# EAGLE schematic POE_REGULADORES (EAGLE 9.6.2)

## Sheet 1 of 5: CONECTOR POE
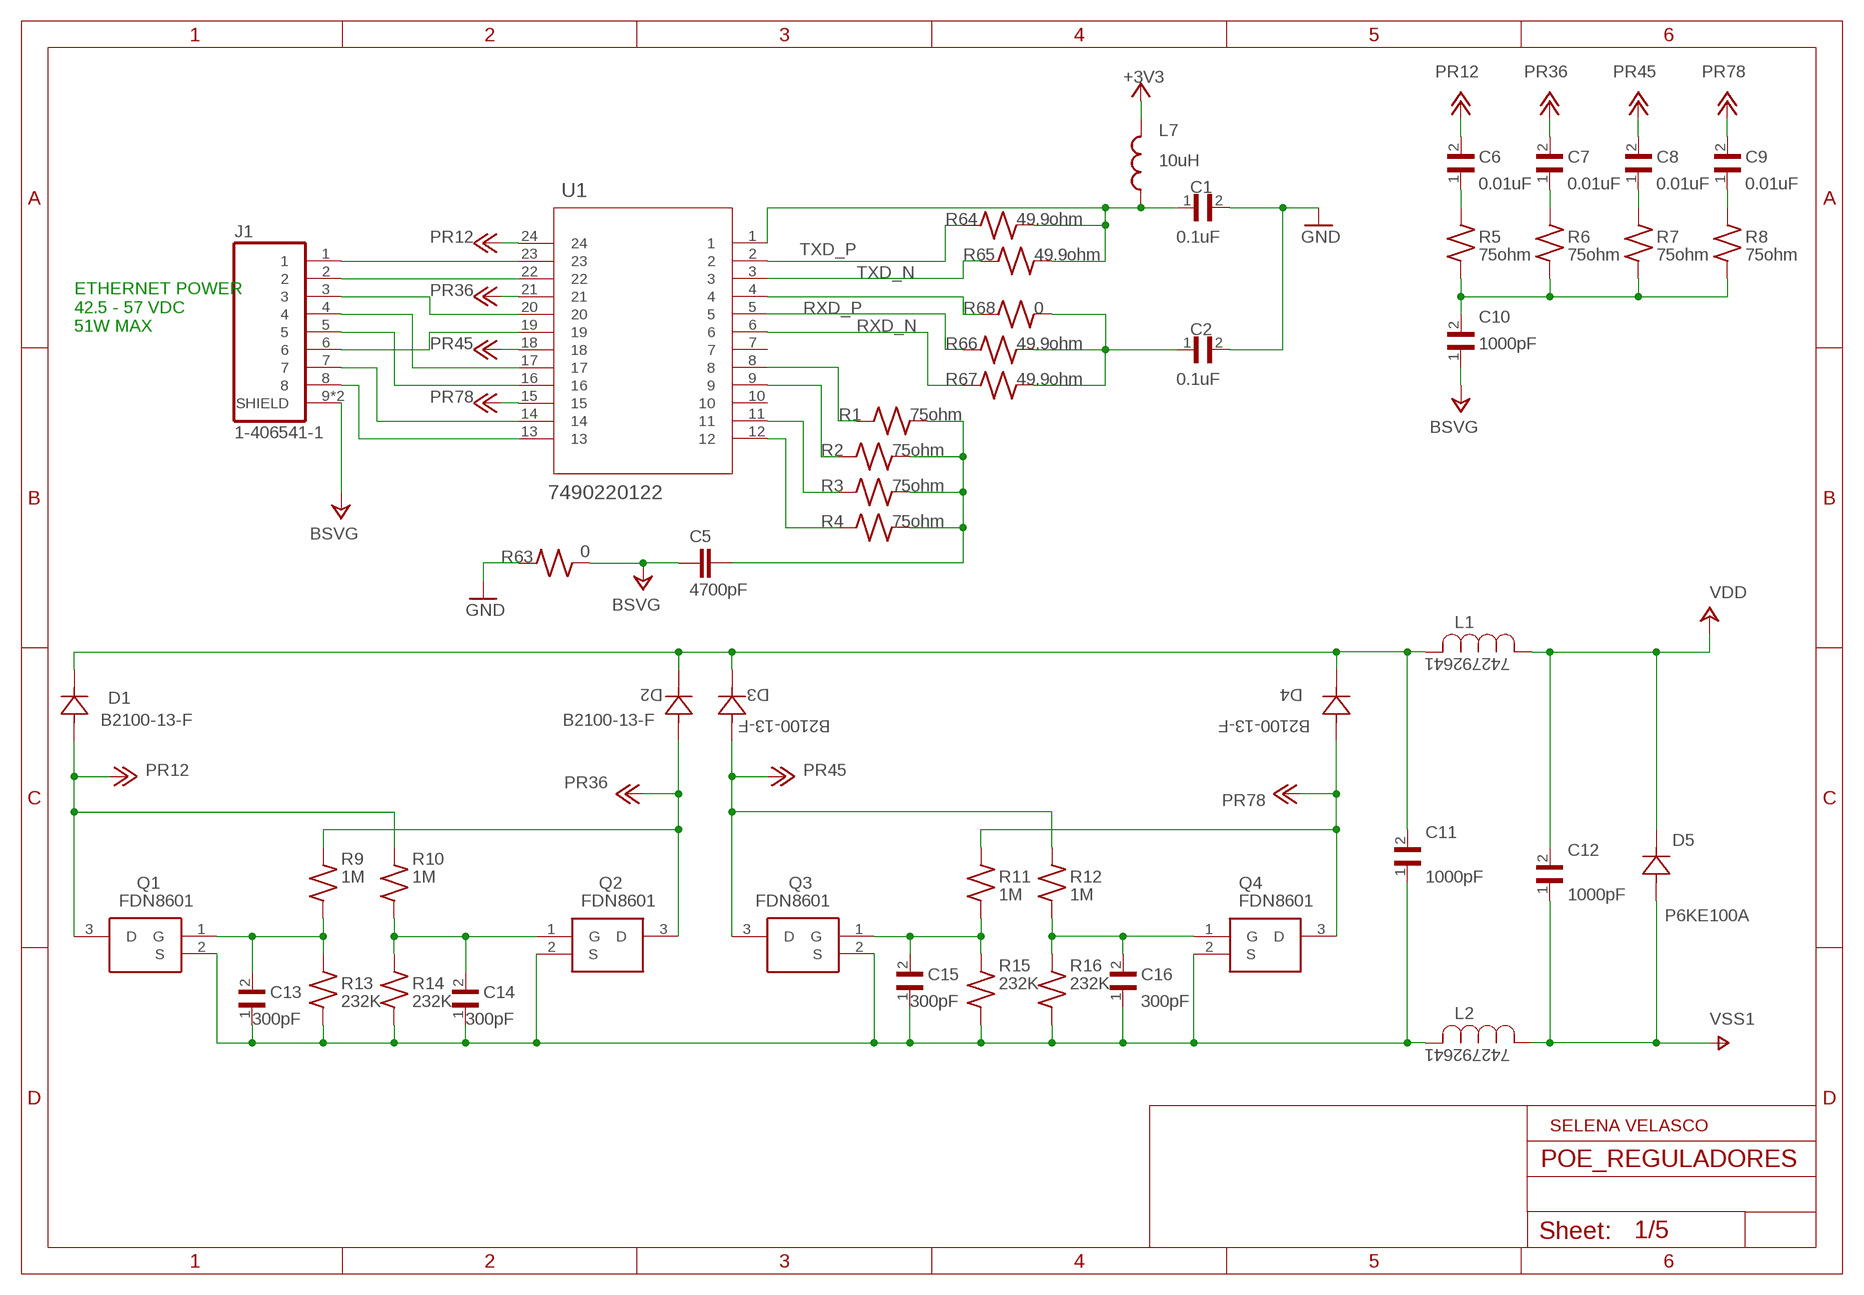
[diagram p0: schematic, sheet 1]

### Parts
C1  0.1uF  C1206Y104K9RAC7800  [CAPC3316X98N]
C2  0.1uF  C1206Y104K9RAC7800  [CAPC3316X98N]
C5  4700pF  C-EUC4532  [C4532]
C6  0.01uF  C1206Y104K9RAC7800  [CAPC3316X98N]
C7  0.01uF  C1206Y104K9RAC7800  [CAPC3316X98N]
C8  0.01uF  C1206Y104K9RAC7800  [CAPC3316X98N]
C9  0.01uF  C1206Y104K9RAC7800  [CAPC3316X98N]
C10  1000pF  GR442QR73D102KW01L  [CAPC4520X150N]
C11  1000pF  C1206Y104K9RAC7800  [CAPC3316X98N]
C12  1000pF  C1206Y104K9RAC7800  [CAPC3316X98N]
C13  300pF  C1206Y104K9RAC7800  [CAPC3316X98N]
C14  300pF  C1206Y104K9RAC7800  [CAPC3316X98N]
C15  300pF  C1206Y104K9RAC7800  [CAPC3316X98N]
C16  300pF  C1206Y104K9RAC7800  [CAPC3316X98N]
D1  B2100-13-F  [SMB_DIO]
D2  B2100-13-F  [SMB_DIO]
D3  B2100-13-F  [SMB_DIO]
D4  B2100-13-F  [SMB_DIO]
D5  P6KE100A  [P6KESERIES_LTF]
J1  1-406541-1  [CONN_1-406541-1]
L1  742792641  [IND_742792641_WRE]
L2  742792641  [IND_742792641_WRE]
L7  10uH  B82422T1103K000  [INDM3225X210N]
Q1  FDN8601  [SOT95P251X112-3N]
Q2  FDN8601  [SOT95P251X112-3N]
Q3  FDN8601  [SOT95P251X112-3N]
Q4  FDN8601  [SOT95P251X112-3N]
R1  75ohm  RC1206FR-071ML  [RESC3116X65N]
R2  75ohm  RC1206FR-071ML  [RESC3116X65N]
R3  75ohm  RC1206FR-071ML  [RESC3116X65N]
R4  75ohm  RC1206FR-071ML  [RESC3116X65N]
R5  75ohm  RC1206FR-071ML  [RESC3116X65N]
R6  75ohm  RC1206FR-071ML  [RESC3116X65N]
R7  75ohm  RC1206FR-071ML  [RESC3116X65N]
R8  75ohm  RC1206FR-071ML  [RESC3116X65N]
R9  1M  RC1206FR-071ML  [RESC3116X65N]
R10  1M  RC1206FR-071ML  [RESC3116X65N]
R11  1M  RC1206FR-071ML  [RESC3116X65N]
R12  1M  RC1206FR-071ML  [RESC3116X65N]
R13  232K  RC1206FR-071ML  [RESC3116X65N]
R14  232K  RC1206FR-071ML  [RESC3116X65N]
R15  232K  RC1206FR-071ML  [RESC3116X65N]
R16  232K  RC1206FR-071ML  [RESC3116X65N]
R63  0  RC1206FR-071ML  [RESC3116X65N]
R64  49.9ohm  RC1206FR-071ML  [RESC3116X65N]
R65  49.9ohm  RC1206FR-071ML  [RESC3116X65N]
R66  49.9ohm  RC1206FR-071ML  [RESC3116X65N]
R67  49.9ohm  RC1206FR-071ML  [RESC3116X65N]
R68  0  RC1206FR-071ML  [RESC3116X65N]
U1  7490220122  [7490220122_WRE]

### Nets
+3V3: L7.2 ; also sheet 4,5
BSVG: C5.1 C10.1 J1.9(SHIELD) J1.10(SHIELD) R63.1
GND: C1.2 C2.2 R63.2 ; also sheet 3,4,5
N$1: J1.1 U1.23
N$2: J1.2 U1.22
N$3: J1.3 U1.20
N$4: J1.4 U1.17
N$5: J1.5 U1.16
N$6: J1.6 U1.19
N$7: J1.7 U1.14
N$8: J1.8 U1.13
N$9: C14.2 Q2.1(G) R10.1 R14.2
N$11: C6.1 R5.2
N$12: C7.1 R6.2
N$13: C8.1 R7.2
N$14: C9.1 R8.2
N$15: C10.2 R5.1 R6.1 R7.1 R8.1
N$16: R1.1 U1.8
N$17: C5.2 R1.2 R2.2 R3.2 R4.2
N$18: R2.1 U1.9
N$19: R3.1 U1.11
N$20: R4.1 U1.12
N$21: C13.2 Q1.1(G) R9.1 R13.2
N$25: C15.2 Q3.1(G) R11.1 R15.2
N$28: C16.2 Q4.1(G) R12.1 R16.2
N$30: C11.2 D1.1 D2.1 D3.1 D4.1 L1.2
N$36: C11.1 C13.1 C14.1 C15.1 C16.1 L2.2 Q1.2(S) Q2.2(S) Q3.2(S) Q4.2(S) R13.1 R14.1 R15.1 R16.1
N$51: R68.1 U1.4
N$64: C2.1 R66.2 R67.2 R68.2
PR12: C6.2 D1.2 Q1.3(D) R10.2 U1.24
PR36: C7.2 D2.2 Q2.3(D) R9.2 U1.21
PR45: C8.2 D3.2 Q3.3(D) R12.2 U1.18
PR78: C9.2 D4.2 Q4.3(D) R11.2 U1.15
RXD_N: R67.1 U1.6 ; also sheet 5
RXD_P: R66.1 U1.5 ; also sheet 5
TXD_CT: C1.1 L7.1 R64.2 R65.2 U1.1
TXD_N: R65.1 U1.3 ; also sheet 5
TXD_P: R64.1 U1.2 ; also sheet 5
VDD: C12.2 D5.1 L1.1 ; also sheet 2,3
VSS1: C12.1 D5.2 L2.1 ; also sheet 2
Unconnected: U1.7 U1.10

### Notes on the sheet
- ETHERNET POWER
  42.5 - 57 VDC
  51W MAX
- SELENA VELASCO

## Sheet 2 of 5: POE_TENSIÓN
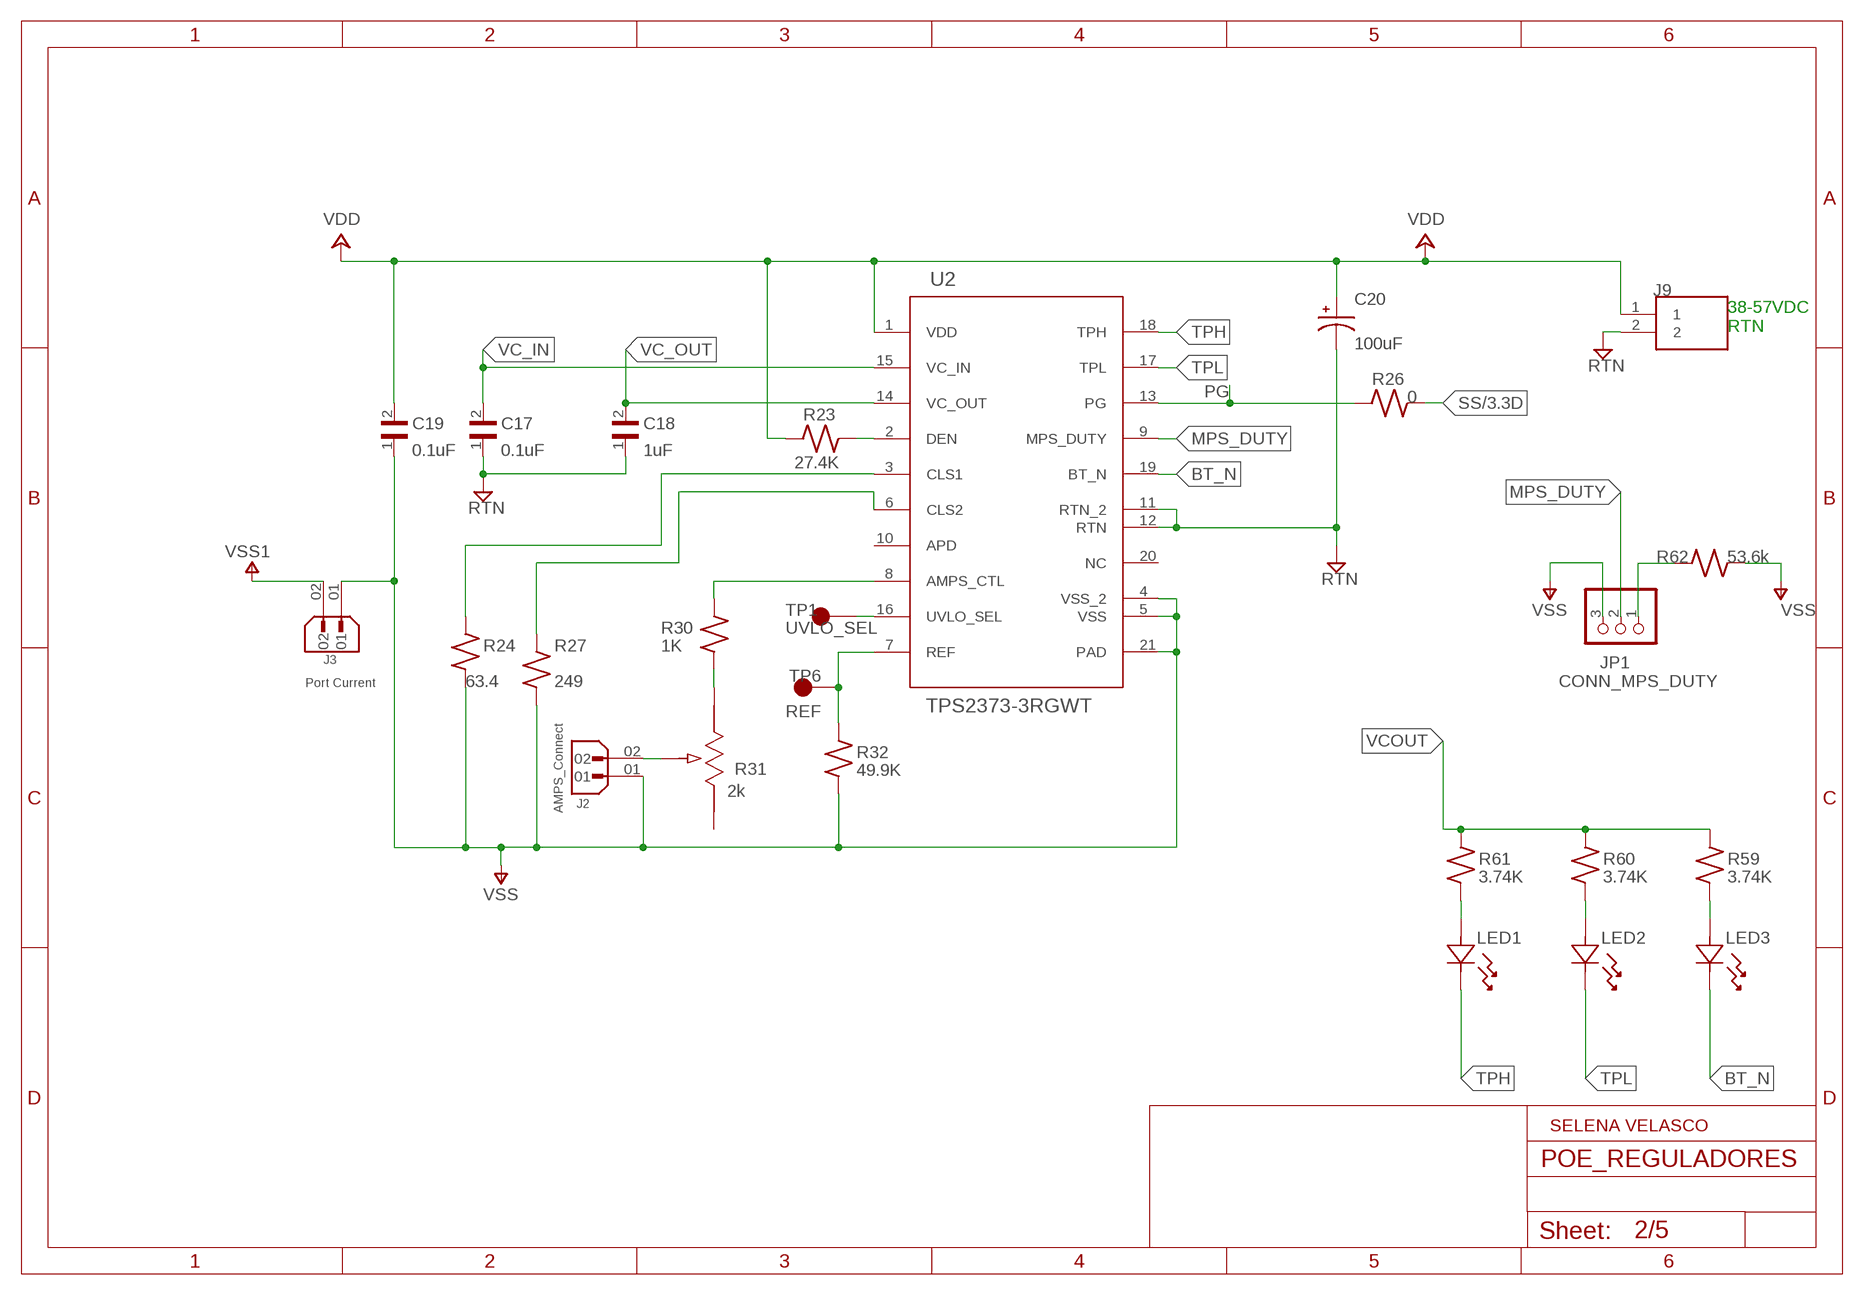
[diagram p1: schematic, sheet 2]

### Parts
C17  0.1uF  C1206Y104K9RAC7800  [CAPC3316X98N]
C18  1uF  C1206Y104K9RAC7800  [CAPC3316X98N]
C19  0.1uF  C1206Y104K9RAC7800  [CAPC3316X98N]
C20  100uF  EEEFK1J470P  [CAP_EEEFK1J470P]
J2  AMPS_Connect  61300211121  [WURTH_61300211121]
J3  Port Current  61300211121  [WURTH_61300211121]
J9  TB001-500-02BE  [CUI_TB001-500-02BE]
JP1  CONN_MPS_DUTY  PINHD-1X3  [1X03]
LED1  BL-BGE1V1  [BL-BGE1V1_AMB]
LED2  BL-BGE1V1  [BL-BGE1V1_AMB]
LED3  BL-BGE1V1  [BL-BGE1V1_AMB]
R23  27.4K  RC1206FR-071ML  [RESC3116X65N]
R24  63.4  RC1206FR-071ML  [RESC3116X65N]
R26  0  RC1206FR-071ML  [RESC3116X65N]
R27  249  RC1206FR-071ML  [RESC3116X65N]
R30  1K  RC1206FR-071ML  [RESC3116X65N]
R31  2k  3386P-1-202LF  [POT_3386P]
R32  49.9K  RC1206FR-071ML  [RESC3116X65N]
R59  3.74K  RC1206FR-071ML  [RESC3116X65N]
R60  3.74K  RC1206FR-071ML  [RESC3116X65N]
R61  3.74K  RC1206FR-071ML  [RESC3116X65N]
R62  53.6k  RC1206FR-071ML  [RESC3116X65N]
TP1  UVLO_SEL  5019  [KEYSTONE_5019]
TP6  REF  5019  [KEYSTONE_5019]
U2  TPS2373-3RGWT  [RGW0020B]

### Nets
BT_N: LED3.1 U2.19(BT_N)
MPS_DUTY: JP1.2 U2.9(MPS_DUTY)
N$10: LED3.2 R59.1
N$22: R24.2 U2.3(CLS1)
N$23: R27.2 U2.6(CLS2)
N$24: R32.2 TP6.TP U2.7(REF)
N$26: R30.1 R31.3
N$27: J2.02 R31.2
N$29: R23.2 U2.2(DEN)
N$31: R30.2 U2.8(AMPS_CTL)
N$32: TP1.TP U2.16(UVLO_SEL)
N$57: JP1.1 R62.2
N$88: LED1.2 R61.1
N$89: LED2.2 R60.1
PG: R26.1 U2.13(PG) ; also sheet 4
RTN: C17.1 C18.1 C20.2 J9.2 U2.11(RTN_2) U2.12(RTN) ; also sheet 3
SS: R26.2 ; also sheet 3
TPH: LED1.1 U2.18(TPH)
TPL: LED2.1 U2.17(TPL)
VC_IN: C17.2 U2.15(VC_IN)
VC_OUT: C18.2 U2.14(VC_OUT)
VCOUT: R59.2 R60.2 R61.2
VDD: C19.2 C20.1 J9.1 R23.1 U2.1(VDD) ; also sheet 1,3
VSS: C19.1 J2.01 J3.01 JP1.3 R24.1 R27.1 R32.1 R62.1 U2.4(VSS_2) U2.5(VSS) U2.21(PAD)
VSS1: J3.02 ; also sheet 1
Unconnected: R31.1 U2.10(APD) U2.20(NC)

### Notes on the sheet
- 38-57VDC
  RTN
- SELENA VELASCO

## Sheet 3 of 5: REGULADOR 12V
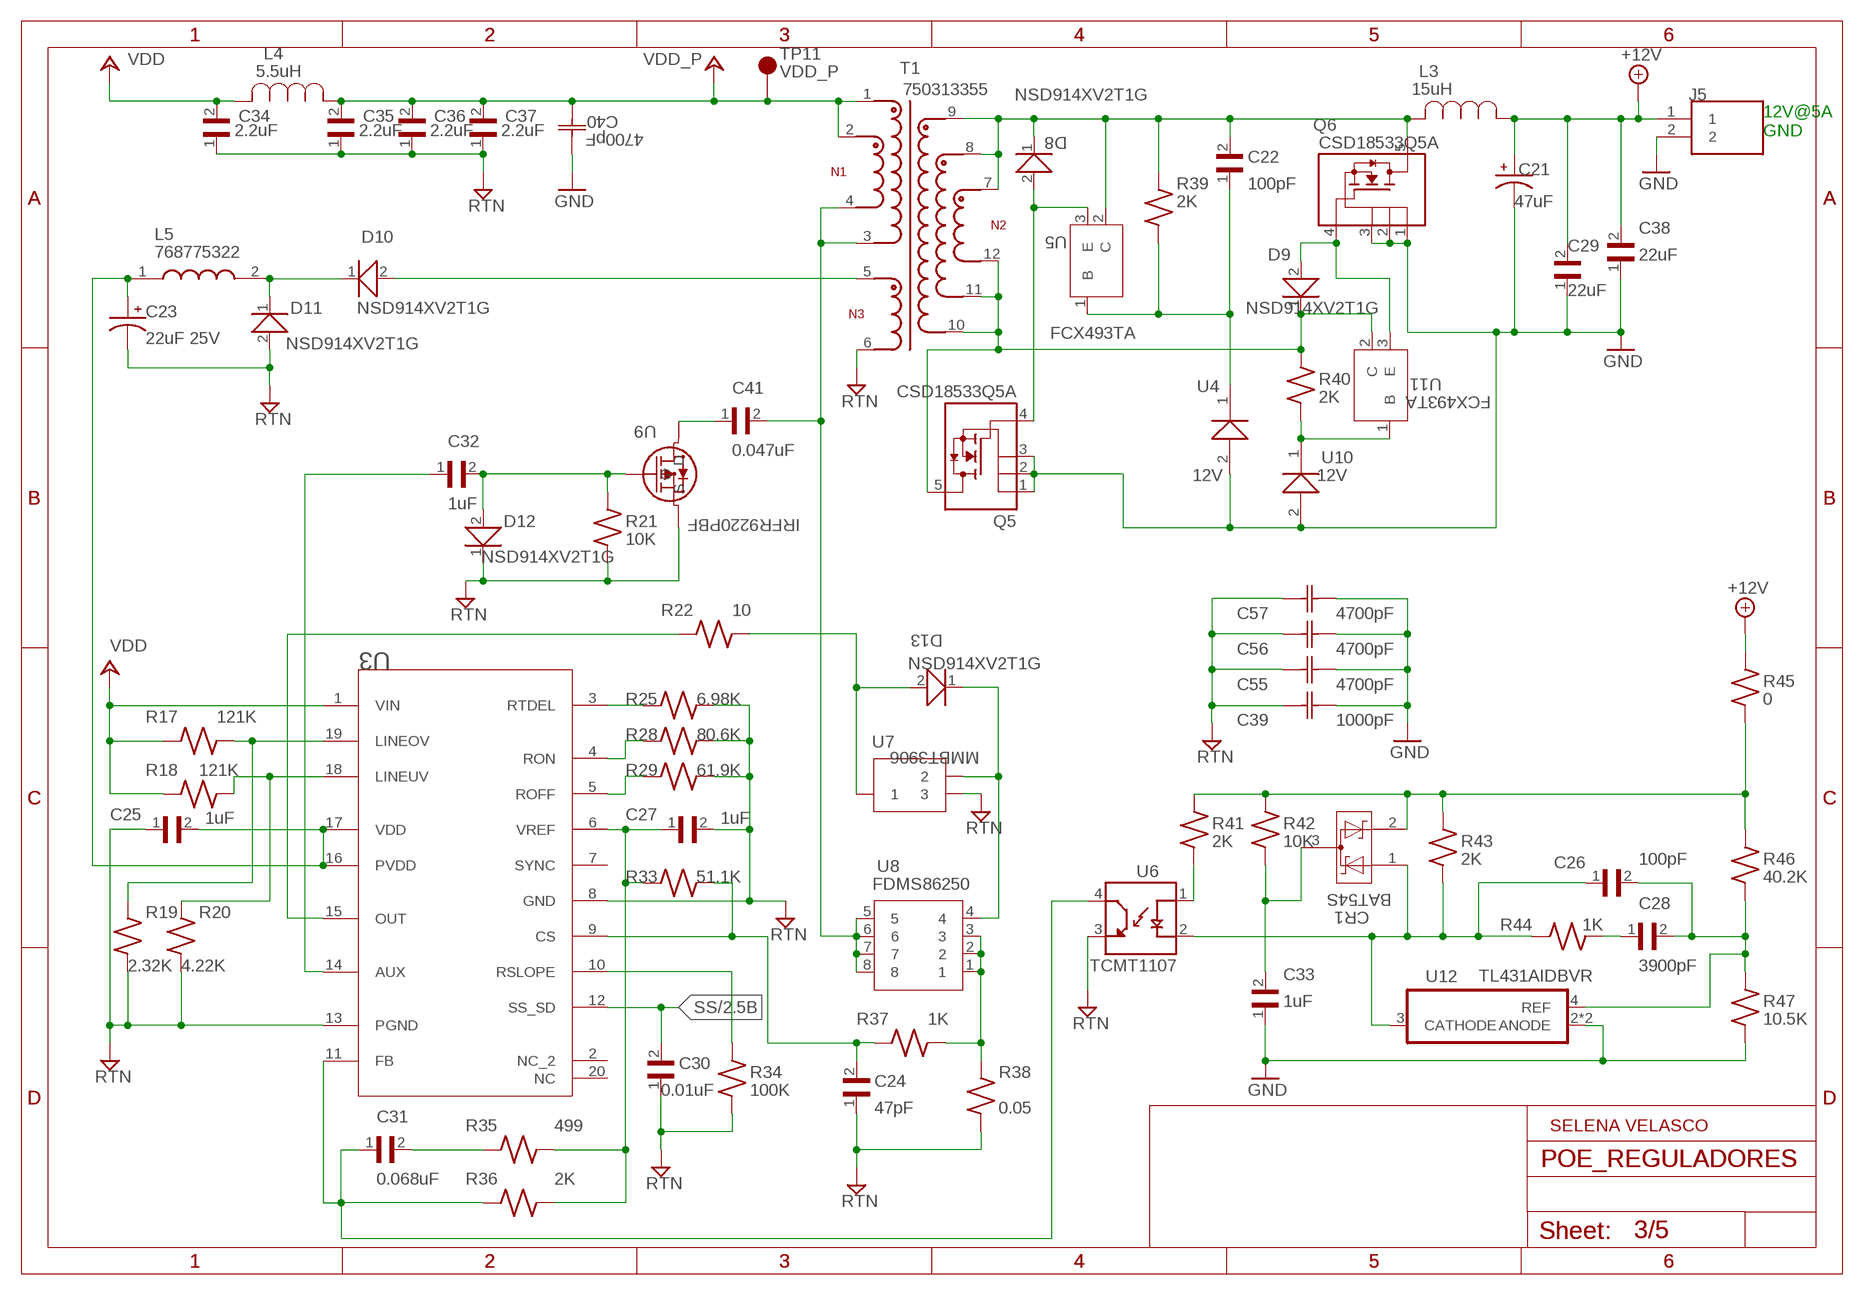
[diagram p2: schematic, sheet 3]

### Parts
C21  47uF  EEEFK1C470P  [CAP_EEEFK1C470P]
C22  100pF  C1206Y104K9RAC7800  [CAPC3316X98N]
C23  22uF 25V  EEEFK1E220R  [CAP_EEEFK1E220R]
C24  47pF  C1206Y104K9RAC7800  [CAPC3316X98N]
C25  1uF  C1206Y104K9RAC7800  [CAPC3316X98N]
C26  100pF  C1206Y104K9RAC7800  [CAPC3316X98N]
C27  1uF  C1206Y104K9RAC7800  [CAPC3316X98N]
C28  3900pF  C1206Y104K9RAC7800  [CAPC3316X98N]
C29  22uF  C1206Y104K9RAC7800  [CAPC3316X98N]
C30  0.01uF  C1206Y104K9RAC7800  [CAPC3316X98N]
C31  0.068uF  C1206Y104K9RAC7800  [CAPC3316X98N]
C32  1uF  C1206Y104K9RAC7800  [CAPC3316X98N]
C33  1uF  C1206Y104K9RAC7800  [CAPC3316X98N]
C34  2.2uF  C1206Y104K9RAC7800  [CAPC3316X98N]
C35  2.2uF  C1206Y104K9RAC7800  [CAPC3316X98N]
C36  2.2uF  C1206Y104K9RAC7800  [CAPC3316X98N]
C37  2.2uF  C1206Y104K9RAC7800  [CAPC3316X98N]
C38  22uF  C1206Y104K9RAC7800  [CAPC3316X98N]
C39  1000pF  1812GC472KAT1A  [CAP_1812_AVX]
C40  4700pF  1812GC472KAT1A  [CAP_1812_AVX]
C41  0.047uF  C1206Y104K9RAC7800  [CAPC3316X98N]
C55  4700pF  1812GC472KAT1A  [CAP_1812_AVX]
C56  4700pF  1812GC472KAT1A  [CAP_1812_AVX]
C57  4700pF  1812GC472KAT1A  [CAP_1812_AVX]
CR1  BAT54S  [SOT-23_TO-236_DTC]
D8  NSD914XV2T1G  [SOD-523_0P9X1P3_ONS]
D9  NSD914XV2T1G  [SOD-523_0P9X1P3_ONS]
D10  NSD914XV2T1G  [SOD-523_0P9X1P3_ONS]
D11  NSD914XV2T1G  [SOD-523_0P9X1P3_ONS]
D12  NSD914XV2T1G  [SOD-523_0P9X1P3_ONS]
D13  NSD914XV2T1G  [SOD-523_0P9X1P3_ONS]
J5  TB001-500-02BE  [CUI_TB001-500-02BE]
L3  15uH  74435571500  [IND_1890_2-WE-HCI_WRE]
L4  5.5uH  744325550  [IND_1050-WE-HCI_WRE]
L5  768775322  [768775322]
Q5  CSD18533Q5A  [TRANS_CSD18533Q5A]
Q6  CSD18533Q5A  [TRANS_CSD18533Q5A]
R17  121K  RC1206FR-071ML  [RESC3116X65N]
R18  121K  RC1206FR-071ML  [RESC3116X65N]
R19  2.32K  RC1206FR-071ML  [RESC3116X65N]
R20  4.22K  RC1206FR-071ML  [RESC3116X65N]
R21  10K  RC1206FR-071ML  [RESC3116X65N]
R22  10  RC1206FR-071ML  [RESC3116X65N]
R25  6.98K  RC1206FR-071ML  [RESC3116X65N]
R28  80.6K  RC1206FR-071ML  [RESC3116X65N]
R29  61.9K  RC1206FR-071ML  [RESC3116X65N]
R33  51.1K  RC1206FR-071ML  [RESC3116X65N]
R34  100K  RC1206FR-071ML  [RESC3116X65N]
R35  499  RC1206FR-071ML  [RESC3116X65N]
R36  2K  RC1206FR-071ML  [RESC3116X65N]
R37  1K  RC1206FR-071ML  [RESC3116X65N]
R38  0.05  RC1206FR-071ML  [RESC3116X65N]
R39  2K  RC1206FR-071ML  [RESC3116X65N]
R40  2K  RC1206FR-071ML  [RESC3116X65N]
R41  2K  RC1206FR-071ML  [RESC3116X65N]
R42  10K  RC1206FR-071ML  [RESC3116X65N]
R43  2K  RC1206FR-071ML  [RESC3116X65N]
R44  1K  RC1206FR-071ML  [RESC3116X65N]
R45  0  RC1206FR-071ML  [RESC3116X65N]
R46  40.2K  RC1206FR-071ML  [RESC3116X65N]
R47  10.5K  RC1206FR-071ML  [RESC3116X65N]
T1  750313355  750313355  [WE-POE++_EFD20_L29.65W21.8H11.43]
TP11  VDD_P  5019  [KEYSTONE_5019]
U3  UCC2897APW  [PW0020A]
U4  12V  MMSZ5242BT3G  [SOD-123_ONS]
U5  FCX493TA  [FCX493TA_DIO]
U6  TCMT1107  [SOIC127P700X230-4N]
U7  MMBT3906  SMMBT3906LT1G  [SOT-23-3_1P4X3P040_ONS]
U8  FDMS86250  [FDMS_86250_ONS]
U9  IRFR9220PBF  [DPAK_VIS]
U10  12V  MMSZ5242BT3G  [SOD-123_ONS]
U11  FCX493TA  [FCX493TA_DIO]
U12  TL431AIDBVR  [SOT95P280X145-5N]

### Nets
+12V: C21.1 C29.2 C38.2 J5.1 L3.1 R45.2 ; also sheet 5
AUX: C32.1 U3.14(AUX)
GND: C21.2 C29.1 C33.1 C38.1 C39.2 C40.1 C55.2 C56.2 C57.2 J5.2 Q5.1(S_1) Q5.2(S_2) Q5.3(S_3) Q6.1(S_1) Q6.2(S_2) Q6.3(S_3) R47.1 U4.2(ANODE) U10.2(ANODE) U12.2(ANODE) U12.5(ANODE) ; also sheet 1,4,5
N$33: D10.2(ANODE) T1.5
N$34: D8.2(ANODE) Q5.4(G) U5.3(E)
N$35: C22.2 D8.1(CATHODE) L3.2 Q6.5(D) R39.2 T1.7 T1.8 T1.9 U5.2(C)
N$37: D13.2(ANODE) R22.2 U7.1
N$38: C26.2 C28.2 R46.1 R47.2 U12.4(REF)
N$39: C31.1 R36.1 U3.11(FB) U6.4(CT)
N$40: C31.2 R35.1
N$41: R41.1 U6.1(A)
N$42: R17.2 R19.2 U3.19(LINEOV)
N$43: R18.2 R20.2 U3.18(LINEUV)
N$44: R25.1 U3.3(RTDEL)
N$45: R28.1 U3.4(RON)
N$46: R29.1 U3.5(ROFF)
N$47: C24.2 R33.2 R37.1 U3.9(CS)
N$48: C27.1 R33.1 R35.2 R36.2 U3.6(VREF)
N$49: R34.2 U3.10(RSLOPE)
N$50: CR1.2(CATHODE2) R41.2 R42.2 R43.2 R45.1 R46.2
N$52: C28.1 R44.1
N$53: R40.1 U10.1(CATHODE) U11.1(B)
N$54: R37.2 R38.2 U8.1 U8.2 U8.3
N$55: D10.1(CATHODE) D11.1(CATHODE) L5.2
N$56: C32.2 D12.2(ANODE) R21.2 U9.1(G)
N$58: C33.2 CR1.3(CATHODE1/ANODE2) R42.1
N$59: C41.2 T1.3 T1.4 U8.5 U8.6 U8.7 U8.8
N$60: D13.1(CATHODE) U7.2 U8.4
N$61: C41.1 U9.2(D)
N$62: C26.1 CR1.1(ANODE1) R43.1 R44.2 U6.2(C) U12.3(CATHODE)
N$63: D9.2(ANODE) Q6.4(G) U11.3(E)
N$65: C22.1 R39.1 U4.1(CATHODE) U5.1(B)
N$66: D9.1(CATHODE) Q5.5(D) R40.2 T1.10 T1.11 T1.12 U11.2(C)
OUT: R22.1 U3.15(OUT)
RTN: C23.2 C24.1 C25.1 C27.2 C30.1 C34.1 C35.1 C36.1 C37.1 C39.1 C55.1 C56.1 C57.1 D11.2(ANODE) D12.1(CATHODE) R19.1 R20.1 R21.1 R25.2 R28.2 R29.2 R34.1 R38.1 T1.6 U3.8(GND) U3.13(PGND) U6.3(ET) U7.3 U9.3(S) ; also sheet 2
SS: C30.2 U3.12(SS_SD) ; also sheet 2
VC: C23.1 C25.2 L5.1 U3.16(PVDD) U3.17(VDD)
VDD: C34.2 L4.2 R17.1 R18.1 U3.1(VIN) ; also sheet 1,2
VDD_P: C35.2 C36.2 C37.2 C40.2 L4.1 T1.1 T1.2 TP11.TP ; also sheet 4
Unconnected: U3.2(NC_2) U3.7(SYNC) U3.20(NC)

### Notes on the sheet
- 12V@5A
  GND
- SELENA VELASCO

## Sheet 4 of 5: REGULADOR 3.3V@120mA
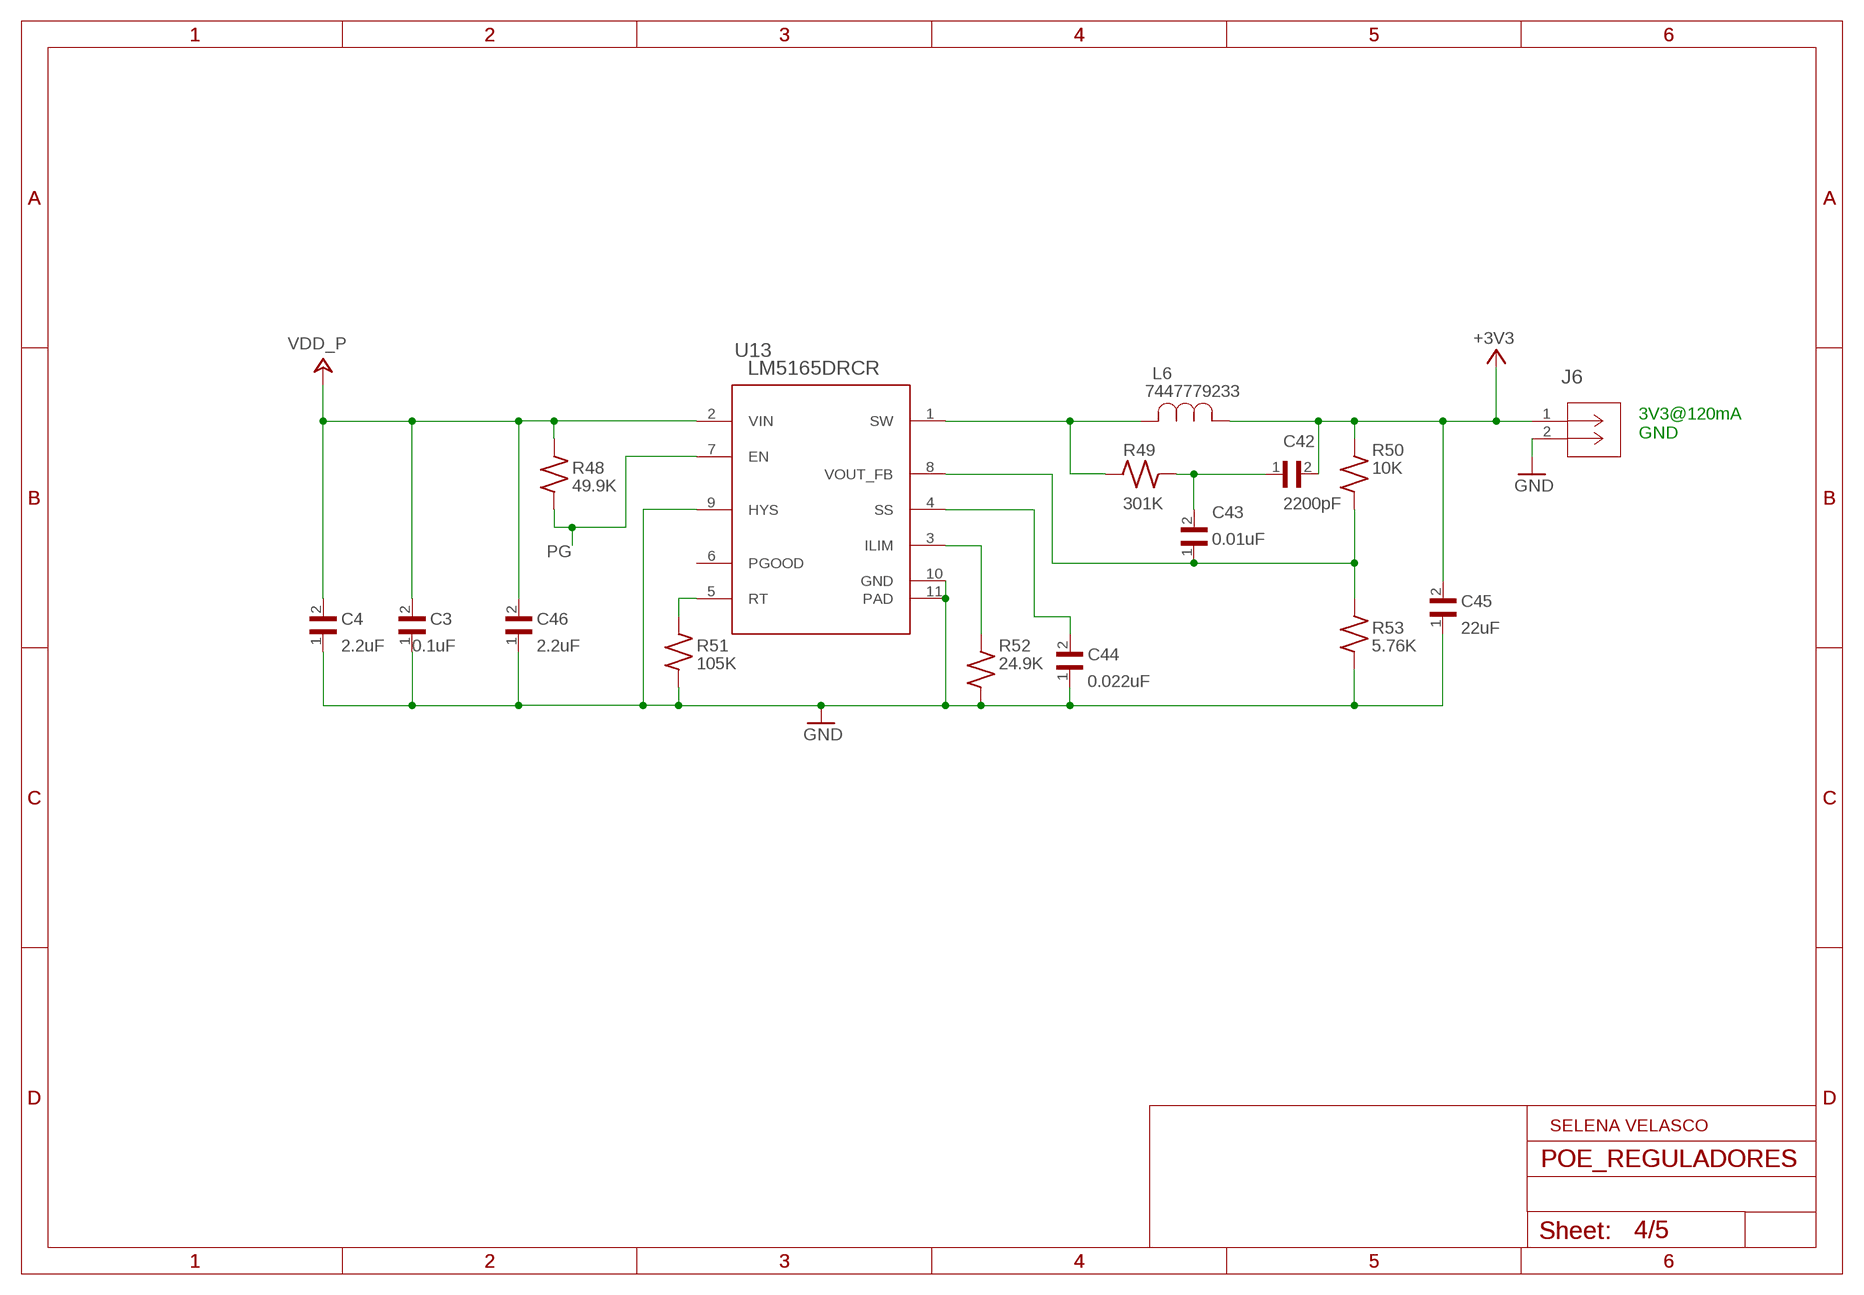
[diagram p3: schematic, sheet 4]

### Parts
C3  0.1uF  C1206Y104K9RAC7800  [CAPC3316X98N]
C4  2.2uF  C1206Y104K9RAC7800  [CAPC3316X98N]
C42  2200pF  C1206Y104K9RAC7800  [CAPC3316X98N]
C43  0.01uF  C1206Y104K9RAC7800  [CAPC3316X98N]
C44  0.022uF  C1206Y104K9RAC7800  [CAPC3316X98N]
C45  22uF  C1206Y104K9RAC7800  [CAPC3316X98N]
C46  2.2uF  C1206Y104K9RAC7800  [CAPC3316X98N]
J6  OSTVN02A150  [CONN_OSTVN02A150_OST]
L6  7447779233  [IND_7345R_WE-PD_WRE]
R48  49.9K  RC1206FR-071ML  [RESC3116X65N]
R49  301K  RC1206FR-071ML  [RESC3116X65N]
R50  10K  RC1206FR-071ML  [RESC3116X65N]
R51  105K  RC1206FR-071ML  [RESC3116X65N]
R52  24.9K  RC1206FR-071ML  [RESC3116X65N]
R53  5.76K  RC1206FR-071ML  [RESC3116X65N]
U13  LM5165DRCR  [DRC0010J]

### Nets
+3V3: C42.2 C45.2 J6.1 L6.1 R50.2 ; also sheet 1,5
GND: C3.1 C4.1 C44.1 C45.1 C46.1 J6.2 R51.1 R52.1 R53.1 U13.9(HYS) U13.10(GND) U13.11(PAD) ; also sheet 1,3,5
N$68: R51.2 U13.5(RT)
N$70: L6.2 R49.1 U13.1(SW)
N$71: C42.1 C43.2 R49.2
N$73: C43.1 R50.1 R53.2 U13.8(VOUT_FB)
N$74: C44.2 U13.4(SS)
N$75: R52.2 U13.3(ILIM)
PG: R48.1 U13.7(EN) ; also sheet 2
VDD_P: C3.2 C4.2 C46.2 R48.2 U13.2(VIN) ; also sheet 3
Unconnected: U13.6(PGOOD)

### Notes on the sheet
- 3V3@120mA
  GND
- SELENA VELASCO

## Sheet 5 of 5: DATA_POE
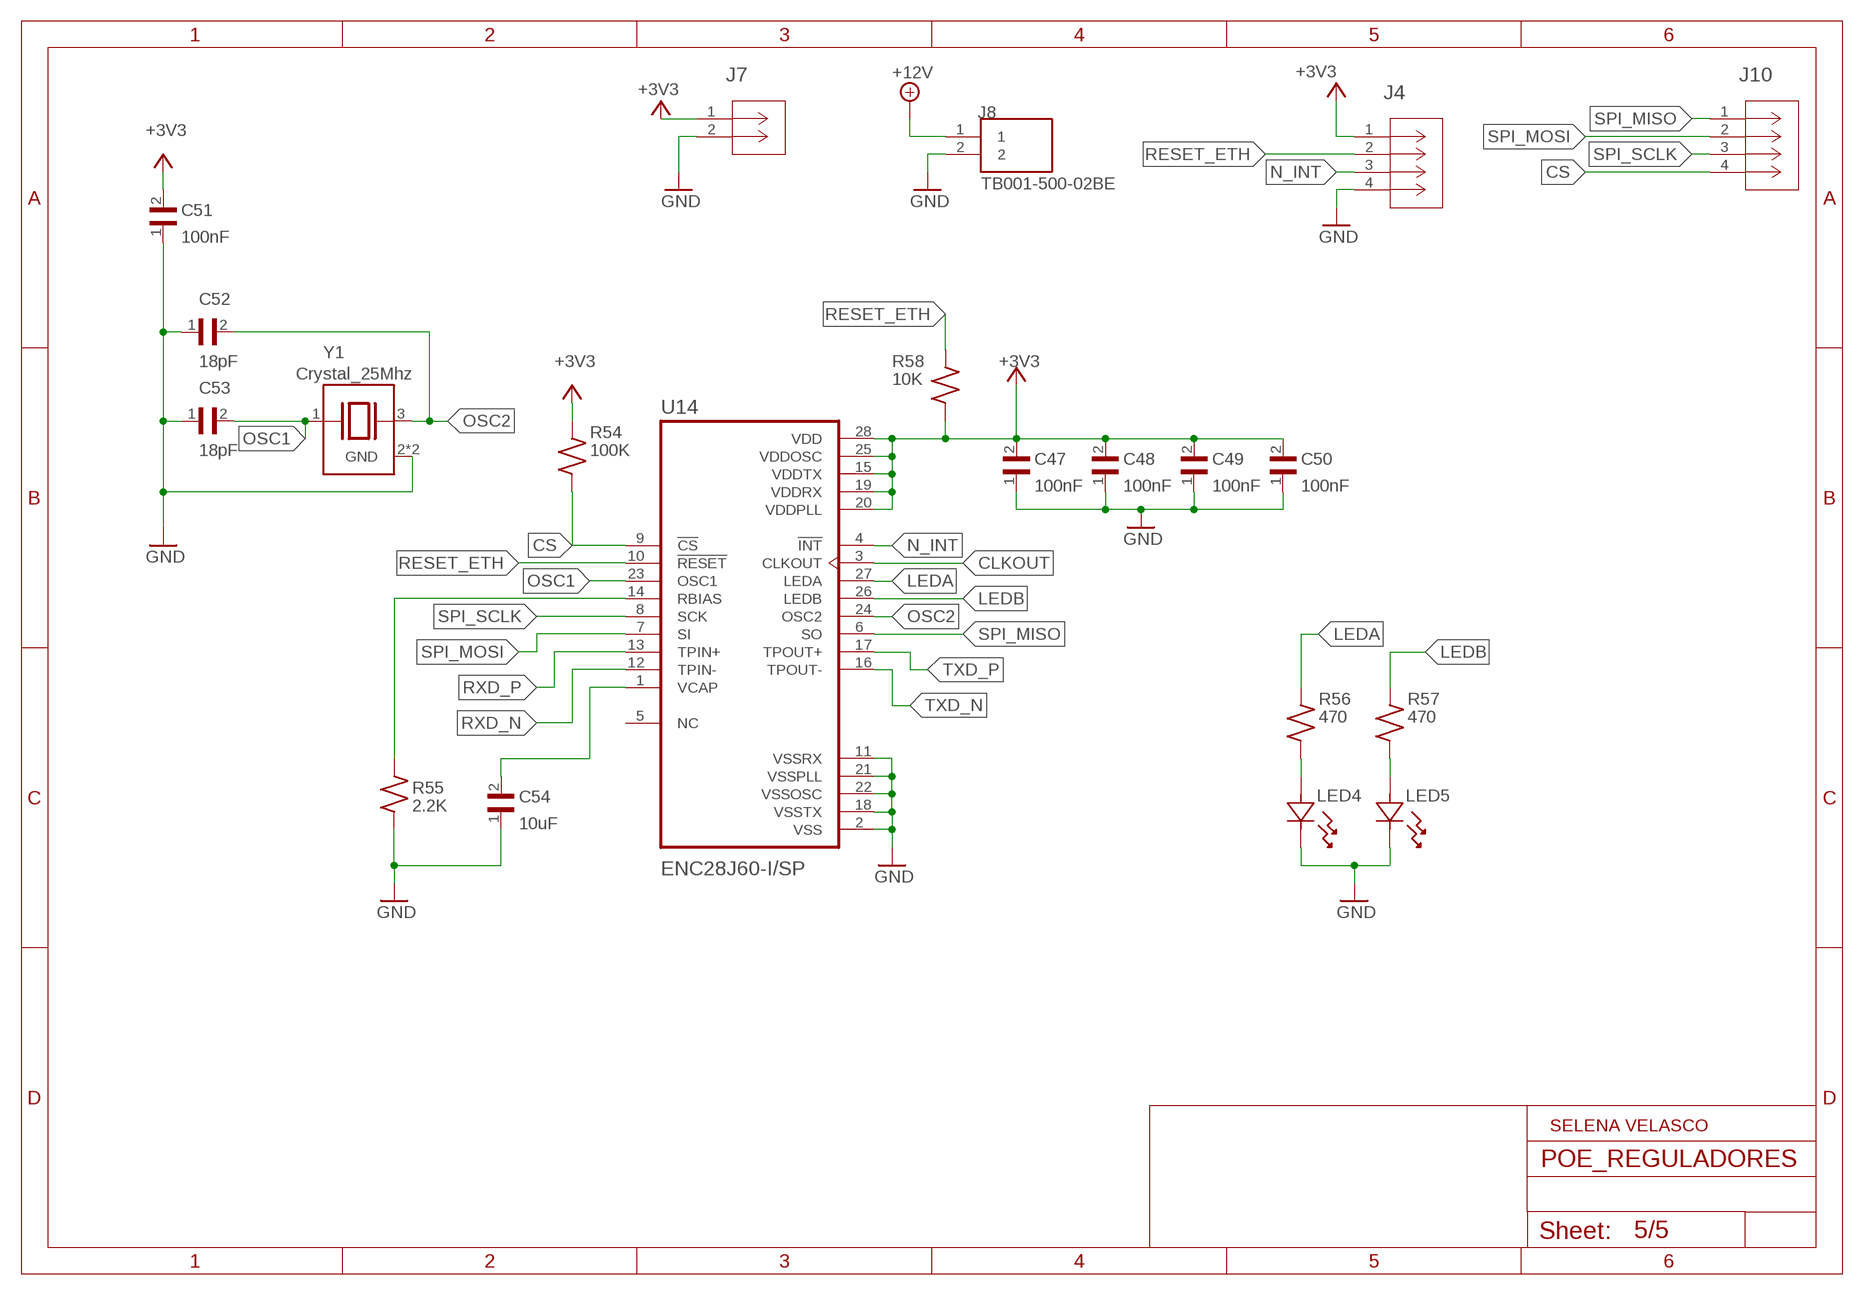
[diagram p4: schematic, sheet 5]

### Parts
C47  100nF  C1206Y104K9RAC7800  [CAPC3316X98N]
C48  100nF  C1206Y104K9RAC7800  [CAPC3316X98N]
C49  100nF  C1206Y104K9RAC7800  [CAPC3316X98N]
C50  100nF  C1206Y104K9RAC7800  [CAPC3316X98N]
C51  100nF  C1206Y104K9RAC7800  [CAPC3316X98N]
C52  18pF  C1206Y104K9RAC7800  [CAPC3316X98N]
C53  18pF  C1206Y104K9RAC7800  [CAPC3316X98N]
C54  10uF  C1206Y104K9RAC7800  [CAPC3316X98N]
J4  OSTVN04A150  [CONN_OSTVN04A150_OST]
J7  OSTVN02A150  [CONN_OSTVN02A150_OST]
J8  TB001-500-02BE  [CUI_TB001-500-02BE]
J10  OSTVN04A150  [CONN_OSTVN04A150_OST]
LED4  BL-BGE1V1  [BL-BGE1V1_AMB]
LED5  BL-BGE1V1  [BL-BGE1V1_AMB]
R54  100K  RC1206FR-071ML  [RESC3116X65N]
R55  2.2K  RC1206FR-071ML  [RESC3116X65N]
R56  470  RC1206FR-071ML  [RESC3116X65N]
R57  470  RC1206FR-071ML  [RESC3116X65N]
R58  10K  RC1206FR-071ML  [RESC3116X65N]
U14  ENC28J60-I/SP  [DIP787W45P254L3556H508Q28]
Y1  Crystal_25Mhz  TSX-3225_25.0000MF10P-C3  [XTAL_TSX-3225_25.0000MF10P-C3]

### Nets
+3V3: C47.2 C48.2 C49.2 C50.2 C51.2 J4.1 J7.1 R54.2 R58.1 U14.15(VDDTX) U14.19(VDDRX) U14.20(VDDPLL) U14.25(VDDOSC) U14.28(VDD) ; also sheet 1,4
+12V: J8.1 ; also sheet 3
CLKOUT: U14.3(CLKOUT)
CS: J10.4 R54.1 U14.9(!CS)
GND: C47.1 C48.1 C49.1 C50.1 C51.1 C52.1 C53.1 C54.1 J4.4 J7.2 J8.2 LED4.1 LED5.1 R55.1 U14.2(VSS) U14.11(VSSRX) U14.18(VSSTX) U14.21(VSSPLL) U14.22(VSSOSC) Y1.2(GND) Y1.4(GND) ; also sheet 1,3,4
LEDA: R56.2 U14.27(LEDA)
LEDB: R57.2 U14.26(LEDB)
N$76: LED4.2 R56.1
N$77: C54.2 U14.1(VCAP)
N$78: R55.2 U14.14(RBIAS)
N$79: LED5.2 R57.1
N_INT: J4.3 U14.4(!INT)
OSC1: C53.2 U14.23(OSC1) Y1.1
OSC2: C52.2 U14.24(OSC2) Y1.3
RESET_ETH: J4.2 R58.2 U14.10(!RESET)
RXD_N: U14.12(TPIN-) ; also sheet 1
RXD_P: U14.13(TPIN+) ; also sheet 1
SPI_MISO: J10.1 U14.6(SO)
SPI_MOSI: J10.2 U14.7(SI)
SPI_SCLK: J10.3 U14.8(SCK)
TXD_N: U14.16(TPOUT-) ; also sheet 1
TXD_P: U14.17(TPOUT+) ; also sheet 1
Unconnected: U14.5(NC)

### Notes on the sheet
- SELENA VELASCO

## Library data of the parts
C1-C4 C6-C9 C11-C19 C22 C24-C38 C41-C54 = C1206Y104K9RAC7800:C1206Y104K9RAC7800
C5 = rcl:C-EU: CAPACITOR, European symbol; SPICEPREFIX: C
C10 = GR442QR73D102KW01L:GR442QR73D102KW01L: SMD Capacitor X7R(EIA) with Capacitance: 1000pF Tol. 10%. Rated Voltage: 2000Vdc
C20 = EEEFK1J470P:EEEFK1J470P; MANUFACTURER: Panasonic; MAXIMUM_PACKAGE_HEIGHT: 10.2mm; PARTREV: 10-Oct-19; STANDARD: Manufacturer Recommendations
C21 = EEEFK1C470P:EEEFK1C470P; MANUFACTURER: Panasonic; MAXIMUM_PACKAGE_HEIGHT: 5.8mm; PARTREV: 10-Oct-19; STANDARD: Manufacturer Recommendations
C23 = EEEFK1E220R:EEEFK1E220R; MANUFACTURER: Panasonic; MAXIMUM_PACKAGE_HEIGHT: 5.8mm; PARTREV: 10-Oct-19; STANDARD: Manufacturer Recommendations
C39 C40 C55-C57 = 1812GC472KAT1A:1812GC472KAT1A; COPYRIGHT: Copyright (C) 2024 Ultra Librarian. All rights reserved.; MANUFACTURER_PART_NUMBER: 1812GC472KAT1A; MFR_NAME: KYOCERA AVX
CR1 = BAT54S:BAT54S; COPYRIGHT: Copyright (C) 2024 Ultra Librarian. All rights reserved.; MANUFACTURER_PART_NUMBER: BAT54S; MFR_NAME: Diotec; TYPE: Diodes - Rectifiers, Arrays
D1-D4 = B2100-13-F:B2100-13-F; COPYRIGHT: Copyright (C) 2024 Ultra Librarian. All rights reserved.; MANUFACTURER_PART_NUMBER: B2100-13-F; MFR_NAME: Diodes Inc
D5 = P6KE68A:P6KE100A; COPYRIGHT: Copyright (C) 2024 Ultra Librarian. All rights reserved.; MANUFACTURER_PART_NUMBER: P6KE100A; MFR_NAME: Littelfuse Inc
D8-D13 = NSD914XV2T1G:NSD914XV2T1G; COPYRIGHT: Copyright (C) 2024 Ultra Librarian. All rights reserved.; MANUFACTURER_PART_NUMBER: NSD914XV2T1G; MFR_NAME: onsemi
J1 = 1-406541-1:1-406541-1: Mod Jack; Right Angle; 8 Position; Cat 5; Shielded; Inverted; Panel & PCB Ground; APPLICATION: Fast Ethernet, 10Base-T Ethernet, and 10/100 Base-T Ethernet; CASE: -; CONFIGURATION: DOUBLE ROW; CONNECTOR: Modular RJ Type Jacks & Plugs; CURRENT_RATING: 1.5A; DESIGNATOR: 1-406541-1; FINISH_CONTACT: GOLD; FOOTPRINT: -; FOOTPRINT_PATH: -; FOOTPRINT_REFERANCE: -; GENDER: -; LATEST_REVISION_NOTE: -; LATEST_REV_DATE: 21APR2017; LIBRARY_PATH: -; LIBRARY_REF: -; MANUFACTURER: TE CONNECTIVITY; MANUFACTURER_LINK: http://www.te.com/commerce/DocumentDelivery/DDEController?Action=showdoc&DocId=Customer+Drawing%7F406541%7FR%7Fpdf%7FEnglish%7FENG_CD_406541_R.pdf%7F1-406541-1; NO_OF_POSITIONS: 8; ORIENTATION: 90° Angle (Right); PACKAGE: THT JACK CONNECTOR; PART_DESCRIPTION: Connector, Jack, 1.02mm, 8 POS, 90° Angle (Right), PCB; PITCH: 1.02 mm; PUBLISHED: 09JAN2008; PUBLISHER: TE_CONNECTIVITY; RESISTANCE: -; ROHS_COMPLIANT: COMPLIANT; SERIES: -; SIGNSL_INTEGRITY: -; SPICE_MODEL: -; TECHNOLOGY: -; TE_PART_NUMBER: 1-406541-1; TYPE: JACK; VOLTAGE_RATING_DC: -
J2 J3 = 61300211121:61300211121: Check availability <https://pricing.snapeda.com/parts/61300211121/W%C3%BCrth%20Elektronik/view-part?ref=eda>; AVAILABILITY: In Stock; DESCRIPTION: Connector Header Through Hole 2 position 0.100 (2.54mm); MF: Würth Elektronik; MP: 61300211121; PACKAGE: None; PRICE: None; PURCHASE-URL: https://pricing.snapeda.com/search/part/61300211121/?ref=eda
J4 J10 = CON4_254MM:OSTVN04A150; COPYRIGHT: Copyright (C) 2024 Ultra Librarian. All rights reserved.; MANUFACTURER_PART_NUMBER: OSTVN04A150; MFR_NAME: On Shore Technology
J5 J8 J9 = TB001-500-02BE:TB001-500-02BE; MANUFACTURER: CUI; STANDARD: Manufacturer Recommendations
J6 J7 = CON2_254MM:OSTVN02A150; COPYRIGHT: Copyright (C) 2024 Ultra Librarian. All rights reserved.; MANUFACTURER_PART_NUMBER: OSTVN02A150; MFR_NAME: On Shore Technology
JP1 = pinhead:PINHD-1X3: PIN HEADER
L1 L2 = 742792641:742792641; COPYRIGHT: Copyright (C) 2024 Ultra Librarian. All rights reserved.; MANUFACTURER_PART_NUMBER: 742792641; MFR_NAME: Wurth Electronics
L3 = 74435571500:74435571500; COPYRIGHT: Copyright (C) 2024 Ultra Librarian. All rights reserved.; MANUFACTURER_PART_NUMBER: 74435571500; MFR_NAME: Wurth Electronics
L4 = 744325550:744325550; COPYRIGHT: Copyright (C) 2024 Ultra Librarian. All rights reserved.; MANUFACTURER_PART_NUMBER: 744325550; MFR_NAME: Wurth Electronics
L5 = 768775322:768775322: Inductor SMD WE-PD2 XL HV 7850 2200uH Wurth WEPD2 Series Shielded Wire-wound SMD Inductor 2200 uH +/-10% 0.15A Idc Source: Datasheet <https://katalog.we-online.de/pbs/datasheet/768775322.pdf>; DESCRIPTION: Inductor SMD WE-PD2 XL HV 7850 2200uH Wurth WEPD2 Series Shielded Wire-wound SMD Inductor 2200 uH +/-10% 0.15A Idc; HEIGHT: 5.4mm; MANUFACTURER_NAME: Wurth Elektronik; MANUFACTURER_PART_NUMBER: 768775322; MOUSER_PART_NUMBER: 710-768775322; MOUSER_PRICE-STOCK: https://www.mouser.co.uk/ProductDetail/Wurth-Elektronik/768775322?qs=VxkwJfKV0FSACNmYR7RlTg%3D%3D
L6 = 7447779233:7447779233; COPYRIGHT: Copyright (C) 2024 Ultra Librarian. All rights reserved.; MANUFACTURER_PART_NUMBER: 7447779233; MFR_NAME: Wurth Electronics
L7 = B82422T1103K000:B82422T1103K000; MANUFACTURER: TDK; MAXIMUM_PACKAGE_HEIGHT: 2.1 mm; PARTREV: N/A; STANDARD: IPC-7351B
LED1-LED5 = LED_3MM:BL-BGE1V1; COPYRIGHT: Copyright (C) 2024 Ultra Librarian. All rights reserved.; MANUFACTURER_PART_NUMBER: BL-BGE1V1; MFR_NAME: American Bright
Q1-Q4 = FDN8601:FDN8601: FDN8601, N-channel MOSFET Transistor, 2.7 A 100 V, 3-Pin SuperSOT3 Source: Datasheet <https://www.onsemi.com/pub/Collateral/FDN8601-D.pdf>; DESCRIPTION: FDN8601, N-channel MOSFET Transistor, 2.7 A 100 V, 3-Pin SuperSOT3; HEIGHT: 1.12mm; MANUFACTURER_NAME: onsemi; MANUFACTURER_PART_NUMBER: FDN8601; MOUSER_PART_NUMBER: 512-FDN8601; MOUSER_PRICE-STOCK: https://www.mouser.co.uk/ProductDetail/ON-Semiconductor-Fairchild/FDN8601?qs=GCVmsggAYMQxsrEidktdfA%3D%3D
Q5 Q6 = CSD18533Q5A:CSD18533Q5A; MANUFACTURER: Texas Instruments; MAXIMUM_PACKAGE_HEIGHT: 1.10 mm; PARTREV: B; STANDARD: Manufacturer Recommendations
R1-R30 R32-R68 = RC1206FR-071ML:RC1206FR-071ML: RES SMT 1M 1% 1206 5K/TR
R31 = 3386P-1-202LF:3386P-1-202LF; COPYRIGHT: Copyright (C) 2024 Ultra Librarian. All rights reserved.; MANUFACTURER_PART_NUMBER: 3386P-1-202LF; MFR_NAME: Bourns Electronics
T1 = 750313355:750313355: WE-PoE++ Power over Ethernet Plus Plus Transformer Characteristics Suitable for CCM Flyback or Active Clamp Forward Different power levels up to 95W Frequency range: 250-400 kHz Different output voltages available Custom designs available Applications Telecom Industrial Applications WLAN Access Point Safety cameras Intelligent LED Lighting Networks <https://www.we-online.com/components/media/o721702v209%20FAMILY-MID-POE%2B%2B.jpg> Details see: www.we-online.com/en/components/products/WE-POE-PLUS-PLUS <www.we-online.com/catalog/WE-POE-PLUS-PLUS/?utm_source=eagle_model&utm_medium=description_link&utm_campaign=eisos_eagle> Created by Ella 2024-01-30 2024(C) Wurth Elektronik; DATASHEET-URL: https://www.we-online.com/redexpert/spec/750313355?ae; IO1: 5A; L: 100uH; LS: 0.85uH; N: 2:1:1; PART-NUMBER: 750313355; SIZE: EFD20; VAUX: 12V; VIN: 36 - 72 V (DC); VO1: 12V; VT: 1500V(AC)
TP1 TP6 TP11 = 5019:5019; MANUFACTURER: Keystone Electronics; MAXIMUM_PACKAGE_HEIGHT: 2.29 mm; PARTREV: D; SNAPEDA_PN: 5019; STANDARD: Manufacturer Recommendations
U1 = 7490220122:7490220122; COPYRIGHT: Copyright (C) 2024 Ultra Librarian. All rights reserved.; MANUFACTURER_PART_NUMBER: 7490220122; MFR_NAME: Wurth Electronics
U2 = TPS2373-3RGWT:TPS2373-3RGWT; COPYRIGHT: Copyright (C) 2024 Ultra Librarian. All rights reserved.; MANUFACTURER_PART_NUMBER: TPS2373-3RGWT; MFR_NAME: Texas Instruments; REFDES: RefDes; TYPE: TYPE
U3 = UCC2897APW:UCC2897APW; COPYRIGHT: Copyright (C) 2024 Ultra Librarian. All rights reserved.; MANUFACTURER_PART_NUMBER: UCC2897APW; MFR_NAME: Texas Instruments
U4 U10 = MMSZ5242BT3G:MMSZ5242BT3G; COPYRIGHT: Copyright (C) 2024 Ultra Librarian. All rights reserved.; MANUFACTURER_PART_NUMBER: MMSZ5242BT3G; MFR_NAME: onsemi
U5 U11 = FCX493TA:FCX493TA; COPYRIGHT: Copyright (C) 2024 Ultra Librarian. All rights reserved.; MANUFACTURER_PART_NUMBER: FCX493TA; MFR_NAME: Diodes Inc
U6 = TCMT1107:TCMT1107; MANUFACTURER: Vishay; MAXIMUM_PACKAGE_HEIGHT: 2.3mm; PARTREV: 3.1; STANDARD: IPC-7351B
U7 = SMMBT3906LT1G:SMMBT3906LT1G; COPYRIGHT: Copyright (C) 2024 Ultra Librarian. All rights reserved.; MANUFACTURER_PART_NUMBER: SMMBT3906LT1G; MFR_NAME: onsemi
U8 = FDMS86250:FDMS86250; COPYRIGHT: Copyright (C) 2024 Ultra Librarian. All rights reserved.; MANUFACTURER_PART_NUMBER: FDMS86250; MFR_NAME: onsemi
U9 = IRFR9220PBF:IRFR9220PBF; COPYRIGHT: Copyright (C) 2024 Ultra Librarian. All rights reserved.; MANUFACTURER_PART_NUMBER: IRFR9220PBF; MFR_NAME: Vishay
U12 = TL431AIDBVR:TL431AIDBVR
U13 = LM5165DRCR:LM5165DRCR; COPYRIGHT: Copyright (C) 2024 Ultra Librarian. All rights reserved.; MANUFACTURER_PART_NUMBER: LM5165DRCR; MFR_NAME: Texas Instruments; REFDES: RefDes; TYPE: TYPE
U14 = ENC28J60-I_SP:ENC28J60-I/SP
Y1 = TSX-3225_25.0000MF10P-C3:TSX-3225_25.0000MF10P-C3; MANUFACTURER: EPSON; MAXIMUM_PACKAGE_HEIGHT: 0.6 mm; PARTREV: N/A; STANDARD: Manufacturer Recommendations